# EAGLE design ECE411_Project1 (EAGLE 9.1.3)
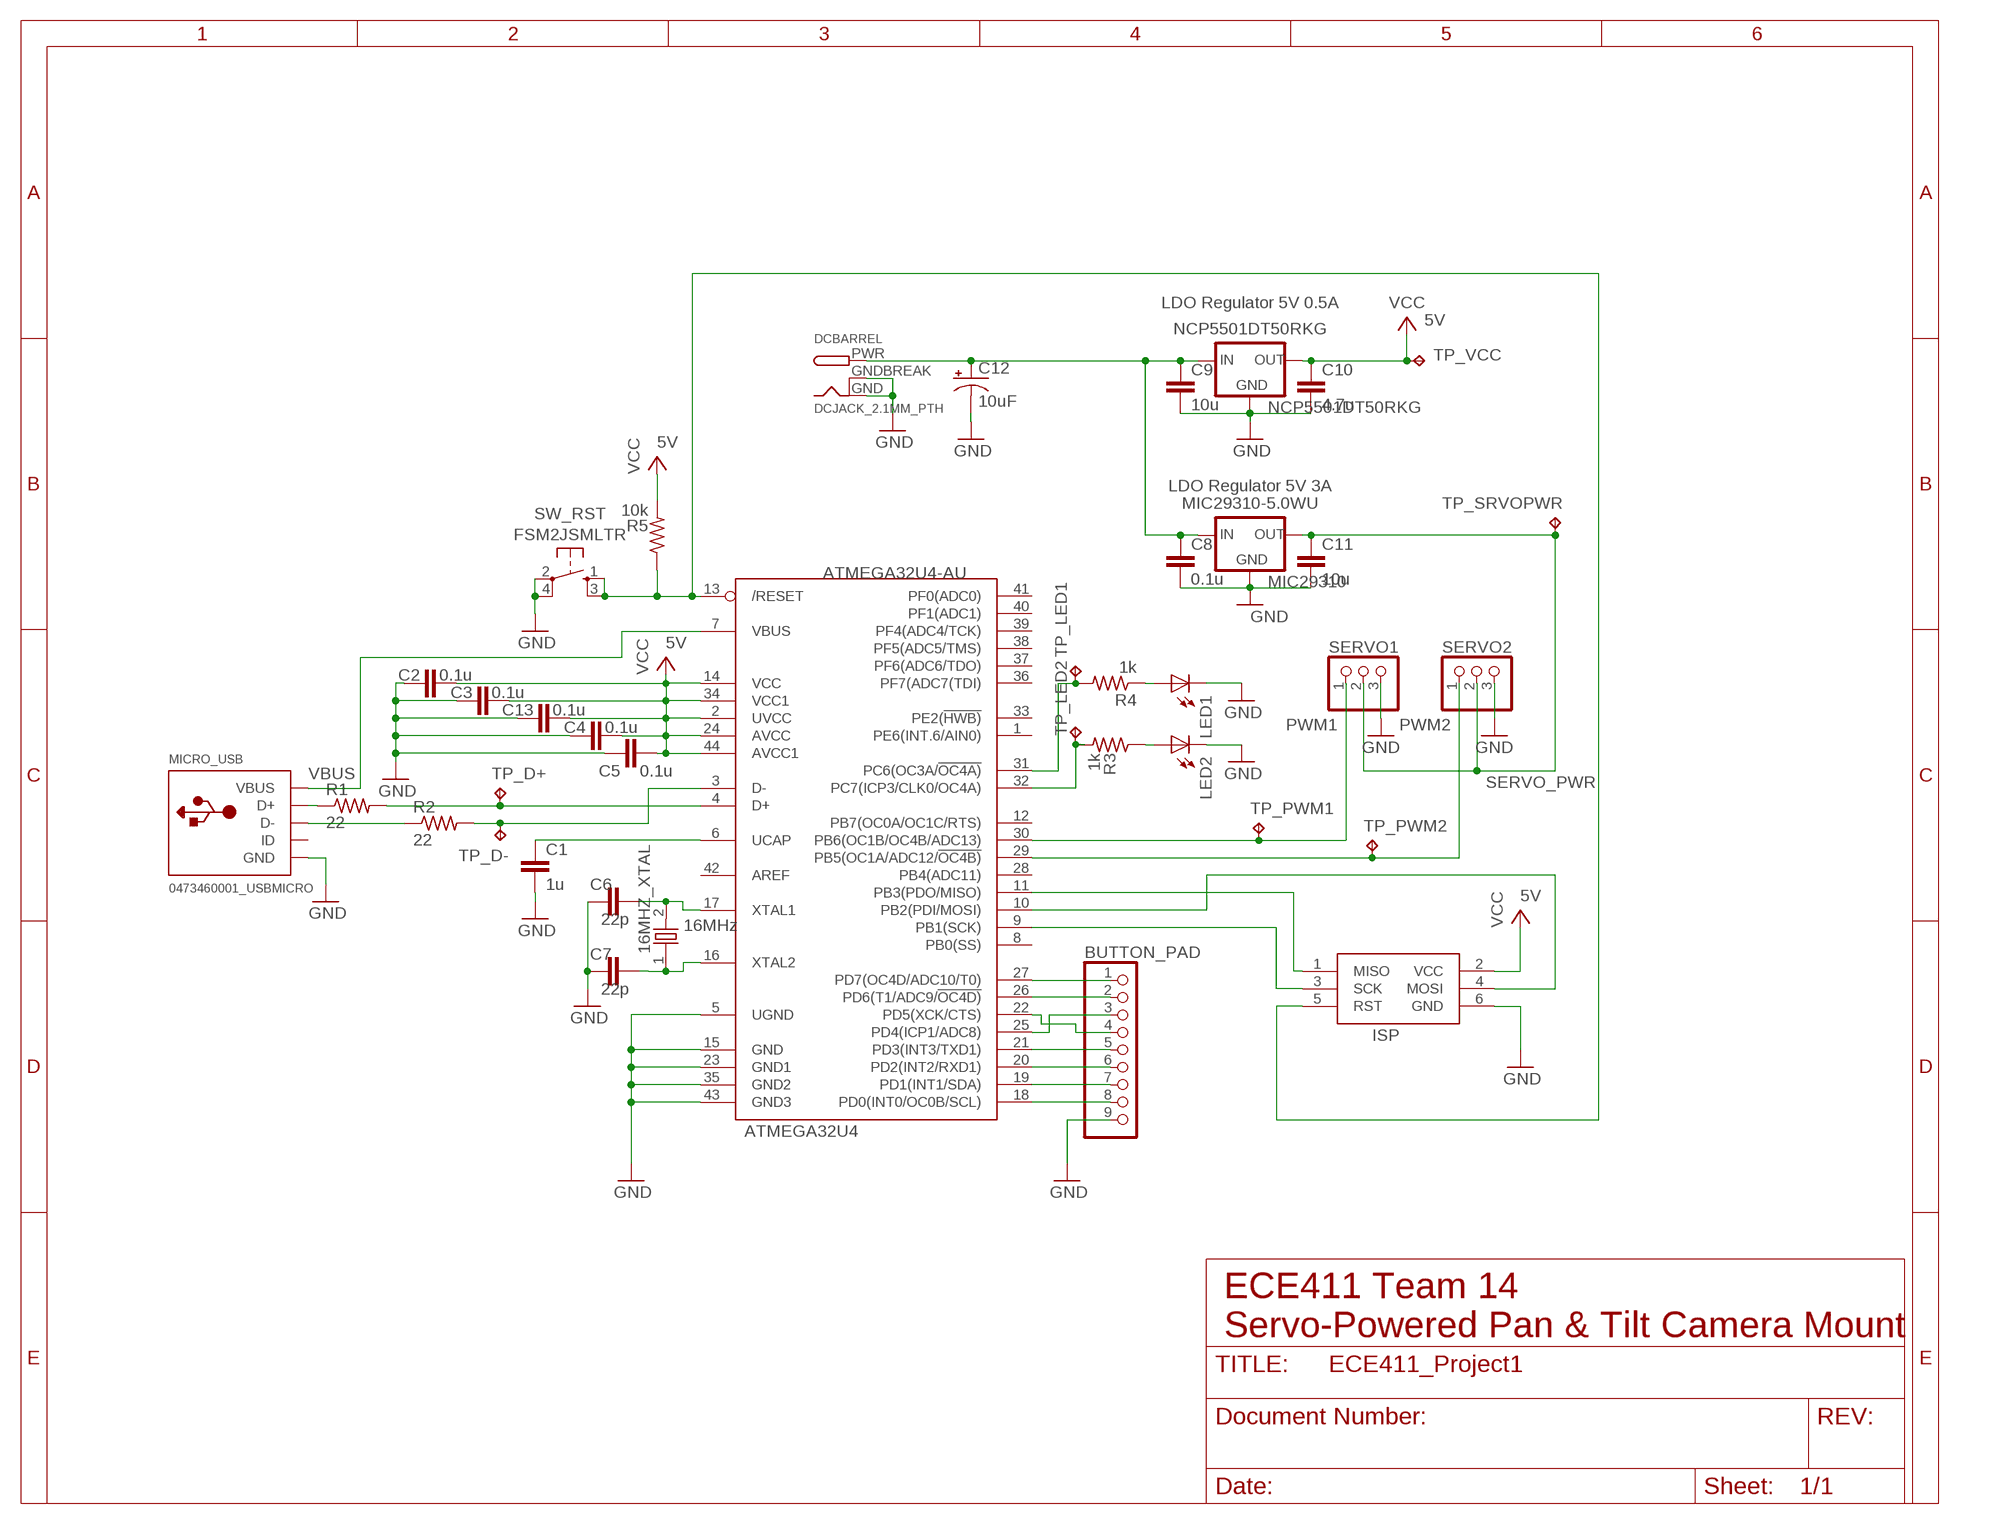
[diagram p0: schematic, sheet 1]

## Parts
16MHZ_XTAL  16MHz  ATS160SM-1  [ATS160SM-1]
ATMEGA32U4  ATMEGA32U4-AU  [TQFP44]
BUTTON_PAD  PINHD-1X9  [1X09]
C1  1u  C-EUC1206  [C1206]
C2  0.1u  C-EUC1206  [C1206]
C3  0.1u  C-EUC1206  [C1206]
C4  0.1u  C-EUC1206  [C1206]
C5  0.1u  C-EUC1206  [C1206]
C6  22p  C-EUC0805  [C0805]
C7  22p  C-EUC0805  [C0805]
C8  0.1u  C-EUC1206  [C1206]
C9  10u  C-EUC1206  [C1206]
C10  4.7u  C-EUC1206  [C1206]
C11  10u  C-EUC1206  [C1206]
C12  10uF  UWT1V100MCL1GB  [UD-5X5,4_NICHICON]
C13  0.1u  C-EUC1206  [C1206]
DCBARREL  DCJACK_2.1MM_PTH  [DCJACK_2.1MM_PTH]
ISP  AVRISP-6  [AVRISP]
LED1  LEDSMT1206  [1206]
LED2  LEDSMT1206  [1206]
MIC29310  MIC29310-5.0WU  [TO-263/D2PAK]
MICRO_USB  0473460001_USBMICRO  [MOLEX_USBMICRO]
NCP5501DT50RKG  NCP5501DT50RKG  [TO-263/D2PAK]
R1  22  R-US_R1206  [R1206]
R2  22  R-US_R1206  [R1206]
R3  1k  R-US_R1206  [R1206]
R4  1k  R-US_R1206  [R1206]
R5  10k  R-US_R1206  [R1206]
SERVO1  PINHD-1X3  [1X03]
SERVO2  PINHD-1X3  [1X03]
SW_RST  FSM2JSMLTR  [FSM2JSMLTR]
TP_D+  TPTP20SQ  [TP20SQ]
TP_D-  TPTP20SQ  [TP20SQ]
TP_LED1  TPTP20SQ  [TP20SQ]
TP_LED2  TPTP20SQ  [TP20SQ]
TP_PWM1  TPTP20SQ  [TP20SQ]
TP_PWM2  TPTP20SQ  [TP20SQ]
TP_SRVOPWR  TPTP20SQ  [TP20SQ]
TP_VCC  TPTP20SQ  [TP20SQ]

## Nets
/RST: ATMEGA32U4.13(/RESET) ISP.5(RST) R5.1 SW_RST.1 SW_RST.3
CHIP_LED1: ATMEGA32U4.31(PC6(OC3A/!OC4A)) R4.2 TP_LED1.TP
CHIP_LED2: ATMEGA32U4.32(PC7(ICP3/CLK0/OC4A)) R3.2 TP_LED2.TP
D+MCU: ATMEGA32U4.4(D+) R1.2 TP_D+.TP
D+USB: MICRO_USB.3(D+) R1.1
D-MCU: ATMEGA32U4.3(D-) R2.2 TP_D-.TP
D-USB: MICRO_USB.2(D-) R2.1
GND: ATMEGA32U4.5(UGND) ATMEGA32U4.15(GND) ATMEGA32U4.23(GND1) ATMEGA32U4.35(GND2) ATMEGA32U4.43(GND3) BUTTON_PAD.9 C1.2 C2.1 C3.1 C4.1 C5.1 C6.1 C7.1 C8.2 C9.2 C10.2 C11.2 C12.- C13.1 DCBARREL.GND DCBARREL.GNDBREAK ISP.6(GND) LED1.C LED2.C MIC29310.2(GND) MICRO_USB.5(GND) MICRO_USB.G1(GND) MICRO_USB.G2(GND) MICRO_USB.G3(GND) MICRO_USB.G4(GND) MICRO_USB.G5(GND) MICRO_USB.G6(GND) NCP5501DT50RKG.2(GND) SERVO1.3 SERVO2.3 SW_RST.2 SW_RST.4
N$1: ATMEGA32U4.27(PD7(OC4D/ADC10/T0)) BUTTON_PAD.1
N$2: ATMEGA32U4.26(PD6(T1/ADC9/!OC4D)) BUTTON_PAD.2
N$3: ATMEGA32U4.25(PD4(ICP1/ADC8)) BUTTON_PAD.3
N$4: ATMEGA32U4.22(PD5(XCK/CTS)) BUTTON_PAD.4
N$5: ATMEGA32U4.21(PD3(INT3/TXD1)) BUTTON_PAD.5
N$7: ATMEGA32U4.20(PD2(INT2/RXD1)) BUTTON_PAD.6
N$9: LED2.A R3.1
N$10: LED1.A R4.1
N$11: ATMEGA32U4.19(PD1(INT1/SDA)) BUTTON_PAD.7
N$12: ATMEGA32U4.18(PD0(INT0/OC0B/SCL)) BUTTON_PAD.8
N$16: ATMEGA32U4.11(PB3(PDO/MISO)) ISP.1(MISO)
N$17: ATMEGA32U4.10(PB2(PDI/MOSI)) ISP.4(MOSI)
N$18: ATMEGA32U4.9(PB1(SCK)) ISP.3(SCK)
PWM1: ATMEGA32U4.30(PB6(OC1B/OC4B/ADC13)) SERVO1.1 TP_PWM1.TP
PWM2: ATMEGA32U4.29(PB5(OC1A/ADC12/!OC4B)) SERVO2.1 TP_PWM2.TP
SERVO_PWR: C11.1 MIC29310.3(OUT) SERVO1.2 SERVO2.2 TP_SRVOPWR.TP
UCAP: ATMEGA32U4.6(UCAP) C1.1
UNREG_PWR: C8.1 C9.1 C12.+ DCBARREL.PWR MIC29310.1(IN) NCP5501DT50RKG.1(IN)
VBUS: ATMEGA32U4.7(VBUS) MICRO_USB.1(VBUS)
VCC: ATMEGA32U4.2(UVCC) ATMEGA32U4.14(VCC) ATMEGA32U4.24(AVCC) ATMEGA32U4.34(VCC1) ATMEGA32U4.44(AVCC1) C2.2 C3.2 C4.2 C5.2 C10.1 C13.2 ISP.2(VCC) NCP5501DT50RKG.3(OUT) R5.2 TP_VCC.TP
XTAL1: 16MHZ_XTAL.2 ATMEGA32U4.17(XTAL1) C6.2
XTAL2: 16MHZ_XTAL.1 ATMEGA32U4.16(XTAL2) C7.2
Unconnected: ATMEGA32U4.1(PE6(INT.6/AIN0)) ATMEGA32U4.8(PB0(SS)) ATMEGA32U4.12(PB7(OC0A/OC1C/RTS)) ATMEGA32U4.28(PB4(ADC11)) ATMEGA32U4.33(PE2(!HWB)) ATMEGA32U4.36(PF7(ADC7(TDI)) ATMEGA32U4.37(PF6(ADC6/TDO)) ATMEGA32U4.38(PF5(ADC5/TMS)) ATMEGA32U4.39(PF4(ADC4/TCK)) ATMEGA32U4.40(PF1(ADC1)) ATMEGA32U4.41(PF0(ADC0)) ATMEGA32U4.42(AREF) MICRO_USB.4(ID)

## Notes on the sheet
- LDO Regulator 5V 0.5A
- LDO Regulator 5V 3A
- ECE411 Team 14
  Servo-Powered Pan & Tilt Camera Mount

## Library data of the parts
16MHZ_XTAL = Xtals:ATS160SM-1
ATMEGA32U4 = adafruit:ATMEGA32U4: http://www.ladyada.net/library/eagle
BUTTON_PAD = pinhead:PINHD-1X9: PIN HEADER
C1 C6-C11 = rcl:C-EU: CAPACITOR, European symbol; SPICEPREFIX: C
C2-C5 C13 = rcl:C-EU: CAPACITOR, European symbol; SPICEPREFIX: C; VENDER: Arrow
C12 = ElectrolyticCap:UWT1V100MCL1GB
DCBARREL = DCBARREL_2.1MM:DCJACK_2.1MM_PTH
ISP = USB_Micro_and_AVRISP:AVRISP: AVR ISP HEADER Standard 6 pin header for AVR programming
LED1 LED2 = led:LED: LED OSRAM: - CHIPLED LG R971, LG N971, LY N971, LG Q971, LY Q971, LO R971, LY R971 LH N974, LH R974 LS Q976, LO Q976, LY Q976 LO Q996 - Hyper CHIPLED LW Q18S LB Q993, LB Q99A, LB R99A - SideLED LS A670, LO A670, LY A670, LG A670, LP A670 LB A673, LV A673, LT A673, LW A673 LH A674 LY A675 LS A676, LA A676, LO A676, LY A676, LW A676 LS A679, LY A679, LG A679 - Hyper Micro SIDELED® LS Y876, LA Y876, LO Y876, LY Y876 LT Y87S - SmartLED LW L88C, LW L88S LB L89C, LB L89S, LG L890 LS L89K, LO L89K, LY L89K LS L896, LA L896, LO L896, LY L896 - TOPLED LS T670, LO T670, LY T670, LG T670, LP T670 LSG T670, LSP T670, LSY T670, LOP T670, LYG T670 LG T671, LOG T671, LSG T671 LB T673, LV T673, LT T673, LW T673 LH T674 LS T676, LA T676, LO T676, LY T676, LB T676, LH T676, LSB T676, LW T676 LB T67C, LV T67C, LT T67C, LS T67K, LO T67K, LY T67K, LW E67C LS E67B, LA E67B, LO E67B, LY E67B, LB E67C, LV E67C, LT E67C LW T67C LS T679, LY T679, LG T679 LS T770, LO T770, LY T770, LG T770, LP T770 LB T773, LV T773, LT T773, LW T773 LH T774 LS E675, LA E675, LY E675, LS T675 LS T776, LA T776, LO T776, LY T776, LB T776 LHGB T686 LT T68C, LB T68C - Hyper Mini TOPLED® LB M676 - Mini TOPLED Santana® LG M470 LS M47K, LO M47K, LY M47K Source: http://www.osram.convergy.de LUXEON: - LUMILED® LXK2-PW12-R00, LXK2-PW12-S00, LXK2-PW14-U00, LXK2-PW14-V00 LXK2-PM12-R00, LXK2-PM12-S00, LXK2-PM14-U00 LXK2-PE12-Q00, LXK2-PE12-R00, LXK2-PE12-S00, LXK2-PE14-T00, LXK2-PE14-U00 LXK2-PB12-K00, LXK2-PB12-L00, LXK2-PB12-M00, LXK2-PB14-N00, LXK2-PB14-P00, LXK2-PB14-Q00 LXK2-PR12-L00, LXK2-PR12-M00, LXK2-PR14-Q00, LXK2-PR14-R00 LXK2-PD12-Q00, LXK2-PD12-R00, LXK2-PD12-S00 LXK2-PH12-R00, LXK2-PH12-S00 LXK2-PL12-P00, LXK2-PL12-Q00, LXK2-PL12-R00 Source: www.luxeon.com KINGBRIGHT: KA-3528ASYC Source: www.kingbright.com
MIC29310 = Regulators:MIC29310-5.0WU: 5V 3A Linear Voltage Regulator Datasheet: http://static6.arrow.com/aropdfconversion/ab7d7dcdfe3eb6b05f8d19ce53e1ca4c92cd3b20/mic29310.pdf
MICRO_USB = USB_Micro_and_AVRISP:0473460001_USBMICRO: USB Micro Connector https://www.molex.com/pdm_docs/sd/473460001_sd.pdf
NCP5501DT50RKG = Regulators:NCP5501DT50RKG: 5V 0.5A Linear Voltage Regulator Datasheet: http://static6.arrow.com/aropdfconversion/b2ea652e33e806fe892d4e0cc98108a95320f27/1535ncp5500-d.pdf
R1-R5 = rcl:R-US_: RESISTOR, American symbol; SPICEPREFIX: R
SERVO1 SERVO2 = pinhead:PINHD-1X3: PIN HEADER
SW_RST = Push_Button:FSM2JSMLTR
TP_D+ TP_D- TP_LED1 TP_LED2 TP_PWM1 TP_PWM2 TP_SRVOPWR TP_VCC = BeagleBone_Blue_R3:TP: Test pad

## Board
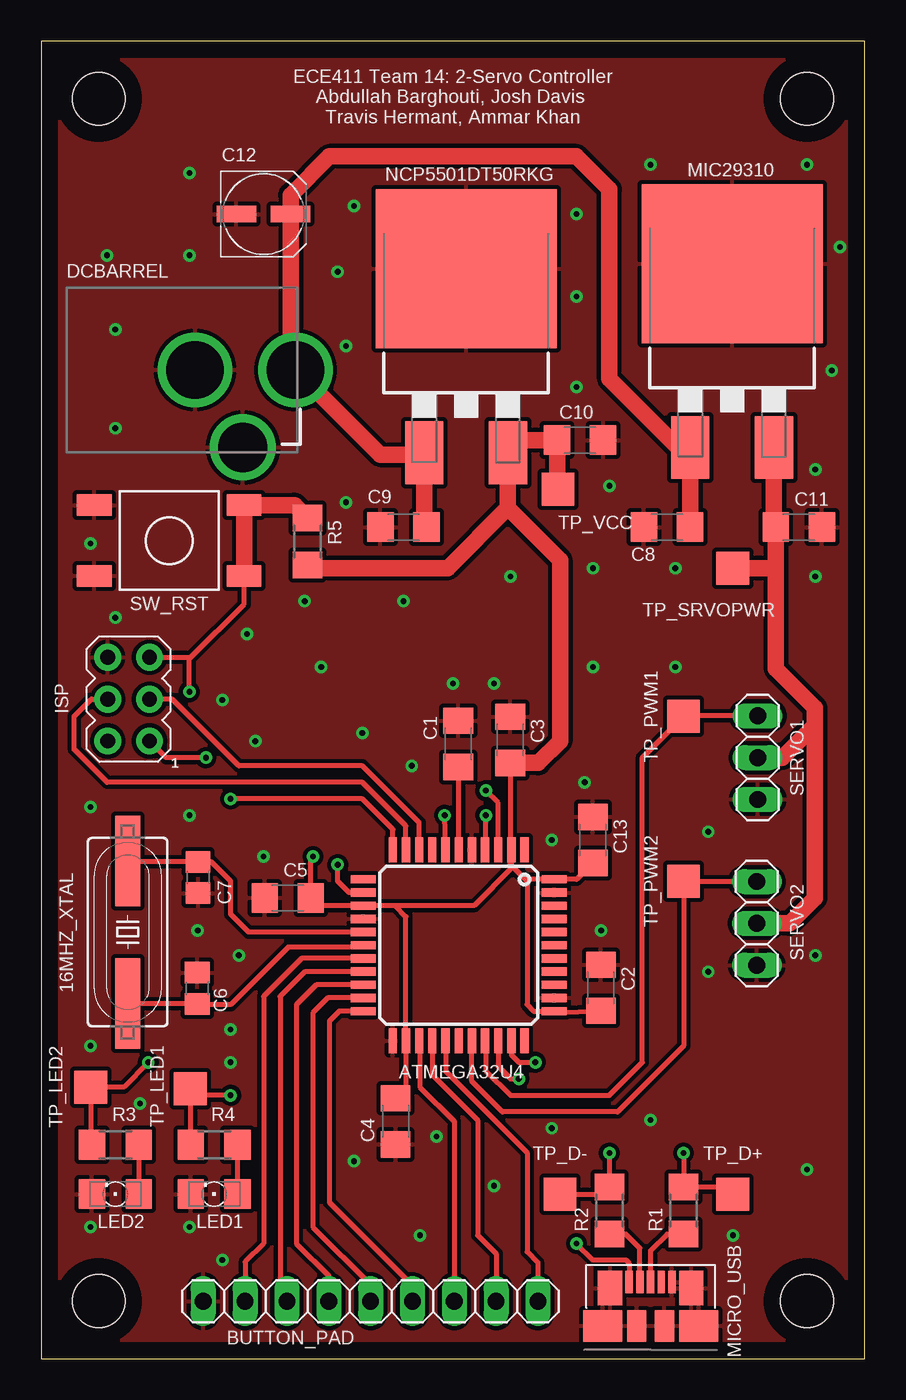
[diagram p1: board, top side]
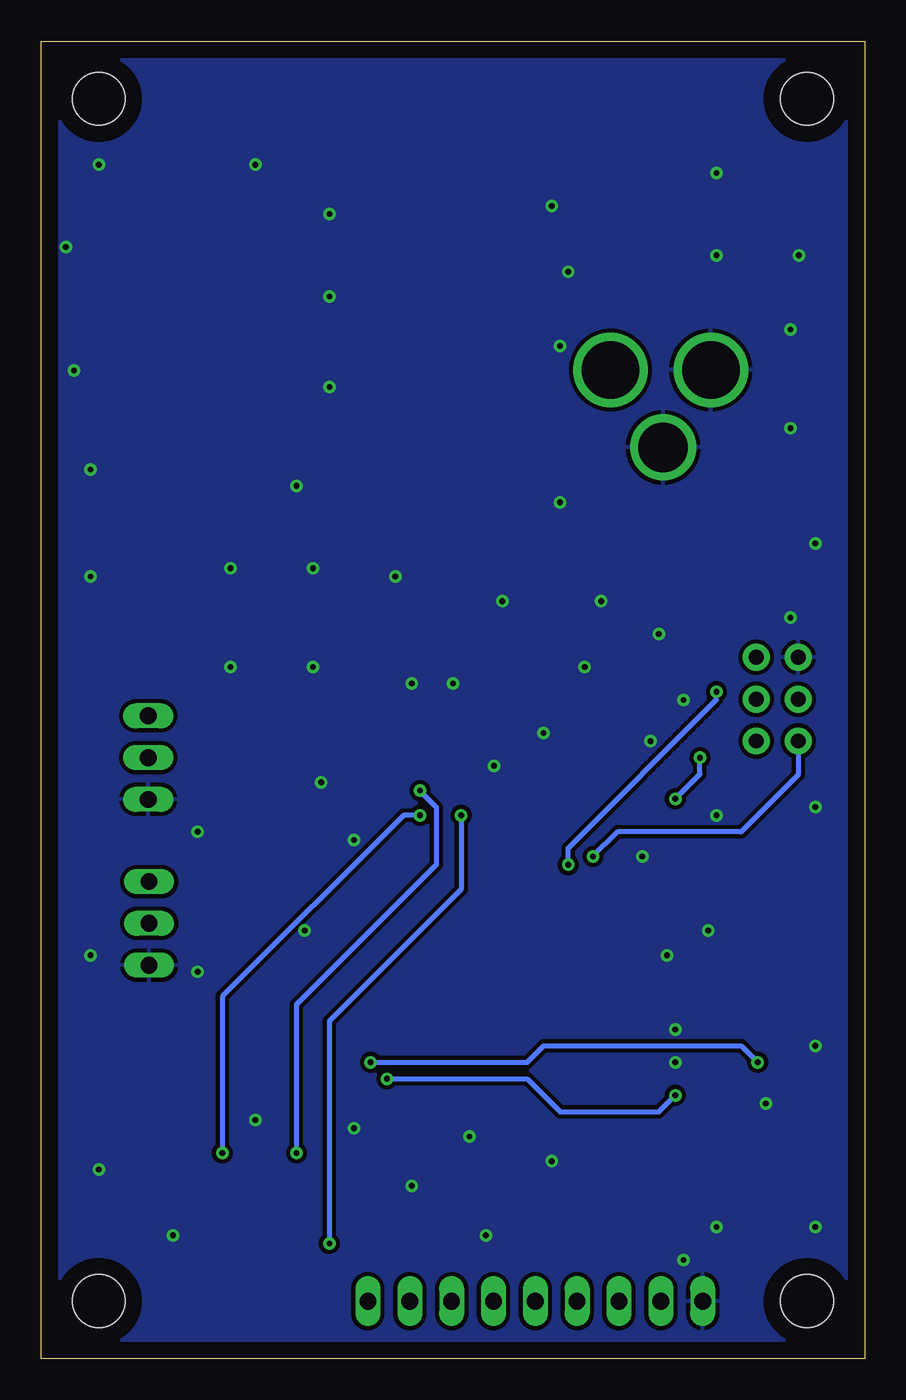
[diagram p2: board, bottom side, seen from below]

Size 50 x 80 mm. Coordinates in mm from the lower left corner, seen from the top.
Outline: 0,0 50,0 50,80 0,80 0,0
Copper layers (1*16): Top 0.035mm / dielectric 1.5mm / Bottom 0.035mm
Design rules "default": minimum track width 6mil, minimum drill 0.35mm, track to track 6mil, track to pad 6mil, pad to pad 6mil, via to via 6mil, smd to smd 6mil, copper to edge 40mil, drill to drill 6mil, minimum pad ring 10mil, minimum via ring 8mil, stop-mask expansion 4mil, vias tented up to drill 0mil, thermal gap 10mil
Holes 3.2 mm at 46.5,3.5 46.5,76.5 3.5,76.5 3.5,3.5

### Footprints (pad centres in the part's own frame; a part is rotated, then mirrored left to right if it is on the bottom)
ATS160SM-1 = smd 5.5 x 1.5: 1 -4.326,0; 2 4.326,0
TQFP44 = smd 1.5 x 0.5: 1 -5.8,4; 2 -5.8,3.2; 3 -5.8,2.4; 4 -5.8,1.6; 5 -5.8,0.8; 6 -5.8,0; 7 -5.8,-0.8; 8 -5.8,-1.6; 9 -5.8,-2.4; 10 -5.8,-3.2; 11 -5.8,-4; 23 5.8,-4; 24 5.8,-3.2; 25 5.8,-2.4; 26 5.8,-1.6; 27 5.8,-0.8; 28 5.8,0; 29 5.8,0.8; 30 5.8,1.6; 31 5.8,2.4; 32 5.8,3.2; 33 5.8,4 | smd 0.5 x 1.5: 12 -4,-5.8; 13 -3.2,-5.8; 14 -2.4,-5.8; 15 -1.6,-5.8; 16 -0.8,-5.8; 17 0,-5.8; 18 0.8,-5.8; 19 1.6,-5.8; 20 2.4,-5.8; 21 3.2,-5.8; 22 4,-5.8; 34 4,5.8; 35 3.2,5.8; 36 2.4,5.8; 37 1.6,5.8; 38 0.8,5.8; 39 0,5.8; 40 -0.8,5.8; 41 -1.6,5.8; 42 -2.4,5.8; 43 -3.2,5.8; 44 -4,5.8
1X09 = drill 1.016 long: 1 -10.16,0; 2 -7.62,0; 3 -5.08,0; 4 -2.54,0; 5 0,0; 6 2.54,0; 7 5.08,0; 8 7.62,0; 9 10.16,0
C1206 = smd 1.6 x 1.8: 1 -1.4,0; 2 1.4,0
C0805 = smd 1.3 x 1.5: 1 -0.95,0; 2 0.95,0
UD-5X5,4_NICHICON = smd 2.4 x 1: + 1.65,0; - -1.65,0
DCJACK_2.1MM_PTH = drill 3.5: GND 0,7.8; PWR 0,13.9 | drill 3: GNDBREAK 4.7,10.7
AVRISP = drill 0.9 pad 1.626: 1 -1.27,2.54; 2 1.27,2.54; 3 -1.27,0; 4 1.27,0; 5 -1.27,-2.54; 6 1.27,-2.54
1206 = smd 1.6 x 1.803: A -1.422,0; C 1.422,0
TO-263/D2PAK = smd 2.32 x 3.81: 1 -2.54,-7.045; 3 2.54,-7.045 | smd 11 x 9.65: 2 0,4.125
MOLEX_USBMICRO = smd 1.38 x 0.45: 1 2.66,1.3; 2 2.66,0.65; 3 2.66,0; 4 2.66,-0.65; 5 2.66,-1.3 | smd 1.9 x 1.175: G1 0,0.838; G2 0,-0.838 | smd 2.1 x 1.475: G3 2.3,2.462; G4 2.3,-2.462 | smd 1.9 x 2.375: G5 0,2.913; G6 0,-2.913
R1206 = smd 1.6 x 1.803: 1 -1.422,0; 2 1.422,0
1X03 = drill 1.016 long: 1 -2.54,0; 2 0,0; 3 2.54,0
FSM2JSMLTR = smd 1.3 x 2.1: 1 -2.15,4.55; 2 -2.15,-4.55; 3 2.15,4.55; 4 2.15,-4.55
TP20SQ = smd 2 x 2: TP 0,0

### Placement (x,y rotation side)
16MHZ_XTAL  5.25,25.91 270 top
ATMEGA32U4  25.35,25.11 270 top
BUTTON_PAD  20,3.5 180 top
C1  25.32,37.34 90 top
C2  33.98,22.53 270 top
C3  28.48,37.58 270 top
C4  21.52,14.42 90 top
C5  14.97,27.98 0 top
C6  9.47,22.5 270 top
C7  9.53,29.22 90 top
C8  38,50.5 180 top
C9  22,50.5 180 top
C10  32.72,55.78 0 top
C11  46,50.5 0 top
C12  13.5,69.5 0 top
C13  33.5,31.5 270 top
DCBARREL  1.54,60.04 270 top
ISP  5.31,40.05 180 top
LED1  10.5,10 180 top
LED2  4.5,10 180 top
MIC29310  41.95,62.37 0 top
MICRO_USB  37,2 90 top
NCP5501DT50RKG  25.8,62.05 0 top
R1  39,9 90 top
R2  34.5,9 90 top
R3  4.5,13 180 top
R4  10.5,13 180 top
R5  16.17,49.62 270 top
SERVO1  43.5,36.5 270 top
SERVO2  43.45,26.44 270 top
SW_RST  7.77,49.68 270 top
TP_D+  42,10 0 top
TP_D-  31.5,10 0 top
TP_LED1  9.04,16.4 180 top
TP_LED2  3,16.5 180 top
TP_PWM1  39,39 270 top
TP_PWM2  39,29 270 top
TP_SRVOPWR  42,48 0 top
TP_VCC  31.38,52.8 0 top

### Tracks (layer width: path | path; a pad name or v marks a point on that pad's centre or on a via)
/RST  (via drill 0.35)
  Top 0.305: ISP.5 9.09,42.59 | SW_RST.3 12.32,45.82 9.09,42.59 | ATMEGA32U4.13 18.69,28.31 18.5,28.5 18,29 v18,30 | v9,40.5 9,42.5 9.09,42.59
  Top 1.016: SW_RST.3 SW_RST.1 15.38,51.83 R5.1
  Bottom 0.305: v9,40.5 9,40 18,31 v18,30
CHIP_LED1  (via drill 0.35)
  Top 0.305: R4.2 9.08,16.36 TP_LED1.TP 9.44,16 v11.5,16 | ATMEGA32U4.31 27.75,17.75 28.5,17 v29,17
  Bottom 0.305: v29,17 20.5,17 18.5,15 12.5,15 v11.5,16
CHIP_LED2  (via drill 0.35)
  Top 0.305: R3.2 3,13.08 TP_LED2.TP 5,16.5 v6.5,18 | ATMEGA32U4.32 28.55,18.45 29,18 v30,18
  Bottom 0.305: v30,18 20.5,18 19.5,19 7.5,19 v6.5,18
D+MCU  (via drill 0.35)
  Top 0.305: ATMEGA32U4.4 27,30.96 v27,33 | TP_D+.TP 41.58,10.42 R1.2 v39,12.5
  Bottom 0.305: v39,12.5 39,22 28,33 v27,33
D+USB
  Top 0.305: MICRO_USB.3 37,6.58 38,7.58 R1.1
D-MCU  (via drill 0.35)
  Top 0.305: ATMEGA32U4.3 27.75,33.75 v27,34.5 | v34.5,12.5 R2.2 34.08,10 TP_D-.TP
  Bottom 0.305: v27,34.5 26,33.5 26,30 34.5,21.5 v34.5,12.5
D-USB
  Top 0.305: MICRO_USB.2 36.35,6.73 35.5,7.58 R2.1
GND  (via drill 0.35)
  other vias: 13,37.5 22.5,36 16,46 22,46 28.5,47.5 34.5,53 47,47.5 9,72 9,67 19,12 23,7.5 31,14 27.5,10.5 42,7.5 37,14.5 9,8 3,8 6,15.5 11.5,20 24,13.5 40.5,23.5 40.5,32 47,24.5 33,35 9.5,26 12,24.5 4.5,45 18.5,52 32.5,59 38.5,48 38.5,42 47,54 18,66 4,67 33.5,42 33.5,48 4.5,56.5 4.5,62.5 32.5,69.5 32.5,64.5 18.5,61.5 19,70 37,72.5 48.5,67.5 46.5,72.5 48,60 34,26 13.5,30.5 3,49.5 46.5,11.5 3,33.5 3,19 9,33 12.5,44 11,40 17,42 25,41 27.5,41 19.5,38 31,31.5 11.5,18 11,6
  pour Top (isolate 0.254): -1,81 -1,-1 51,-1 51,81
  pour Bottom (isolate 0.254): 0.5,0 50,0 50,80 0,80 0,0
N$1
  Top 0.305: ATMEGA32U4.27 24.55,17.45 29.5,12.5 29.5,6.5 30.16,5.84 BUTTON_PAD.1
N$2
  Top 0.305: ATMEGA32U4.26 23.75,17.25 26.5,14.5 26.5,7.5 27.62,6.38 BUTTON_PAD.2
N$3
  Top 0.305: ATMEGA32U4.25 23,19.26 23,16.5 25.08,14.42 BUTTON_PAD.3
N$4
  Top 0.305: ATMEGA32U4.22 18.11,21.11 17.5,20.5 17.5,9.5 22.54,4.46 BUTTON_PAD.4
N$5
  Top 0.305: ATMEGA32U4.21 17.41,21.91 16.5,21 16.5,8 20,4.5 BUTTON_PAD.5
N$7
  Top 0.305: ATMEGA32U4.20 16.71,22.71 15.5,21.5 15.5,7 17.46,5.04 BUTTON_PAD.6
N$9
  Top 0.305: R3.1 LED2.A
N$10
  Top 0.305: LED1.A R4.1
N$11
  Top 0.305: ATMEGA32U4.19 16,23.5 14.5,22 14.5,3.92 BUTTON_PAD.7
N$12
  Top 0.305: ATMEGA32U4.18 15.81,24.31 13.5,22 13.5,7 12.38,5.88 BUTTON_PAD.8
N$16  (via drill 0.35)
  Top 0.305: ATMEGA32U4.11 21.35,32.15 19.5,34 v11.5,34 | v10,36.5 7.59,36.5 ISP.1
  Bottom 0.305: v11.5,34 10,35.5 v10,36.5
N$17
  Top 0.305: ATMEGA32U4.10 22.15,32.35 19.5,35 4,35 2,37 2,39 3.05,40.05 ISP.4
N$18
  Top 0.305: ATMEGA32U4.9 22.95,32.55 19.5,36 12,36 7.95,40.05 ISP.3
PWM1
  Top 0.305: SERVO1.1 38.96,39.04 TP_PWM1.TP 36.5,36.5 36.5,18 34.5,16 28.5,16 27,17.5 27,19.26 ATMEGA32U4.30
PWM2
  Top 0.305: SERVO2.1 39.02,28.98 TP_PWM2.TP 39,19 35,15 28,15 26.15,16.85 ATMEGA32U4.29
SERVO_PWR
  Top 1.016: 44.6,48 C11.1 44.49,50.61 MIC29310.3 | 44.6,48 44.6,41.9 46.98,39.52 | SERVO2.2 45.44,26.44 46.98,27.98 46.98,39.52 | 46.98,39.52 46.98,38.48 45,36.5 SERVO1.2 | 44.6,48 TP_SRVOPWR.TP
UCAP
  Top 0.305: ATMEGA32U4.6 25.35,35.91 C1.1
UNREG_PWR
  Top 1.016: C8.1 MIC29310.1 38.67,55.33 34.5,59.5 34.5,71 32.5,73 17.5,73 15.15,70.65 C12.+ 15.15,60.33 DCBARREL.PWR 20.59,54.9 23.37,54.9 23.36,54.9 NCP5501DT50RKG.1 23.26,50.64 C9.1
VBUS  (via drill 0.35)
  Top 0.305: ATMEGA32U4.7 v24.5,33 | v32.5,7 33.5,6 35.5,6 35.7,5.8 MICRO_USB.1
  Bottom 0.305: v24.5,33 24.5,28.5 32.5,20.5 v32.5,7
VCC  (via drill 0.35)
  Top 0.305: C4.2 22.15,16.45 ATMEGA32U4.24 22.15,26.85 21.49,27.51 21,27.51 | C2.2 31.24,21.02 ATMEGA32U4.34 29.89,21.11 29.5,21.5 29.5,29 | C13.2 32.51,29.11 ATMEGA32U4.44 29.61,29.11 29.5,29 | C3.2 28.48,30.98 | 28.48,30.98 ATMEGA32U4.2 28.55,29.78 26.28,27.51 21,27.51 | v16.5,30.5 16.37,30.37 C5.2 16.84,27.51 ATMEGA32U4.14 21,27.51 | 29.5,29 28.48,30.02 28.48,30.98
  Top 1.016: TP_VCC.TP 31.32,52.86 C10.1 29.11,55.78 NCP5501DT50RKG.3 28.34,51.66 | C3.2 30.18,36.18 31.5,37.5 31.5,48.5 28.34,51.66 | 28.34,51.66 24.68,48 16.37,48 R5.2
  Bottom 0.305: ISP.2 4.04,35.46 7.5,32 15,32 v16.5,30.5
XTAL1
  Top 0.305: ATMEGA32U4.17 19.44,25 15,25 11.5,21.5 9.52,21.5 C6.2 5.28,21.55 16MHZ_XTAL.2
XTAL2
  Top 0.305: ATMEGA32U4.16 12.59,25.91 11.5,27 11.5,29 10.33,30.17 C7.2 5.32,30.17 16MHZ_XTAL.1

### Text on the board
tPlace: ECE411 Team 14: 2-Servo Controller / Abdullah Barghouti, Josh Davis / Travis Hermant, Ammar Khan